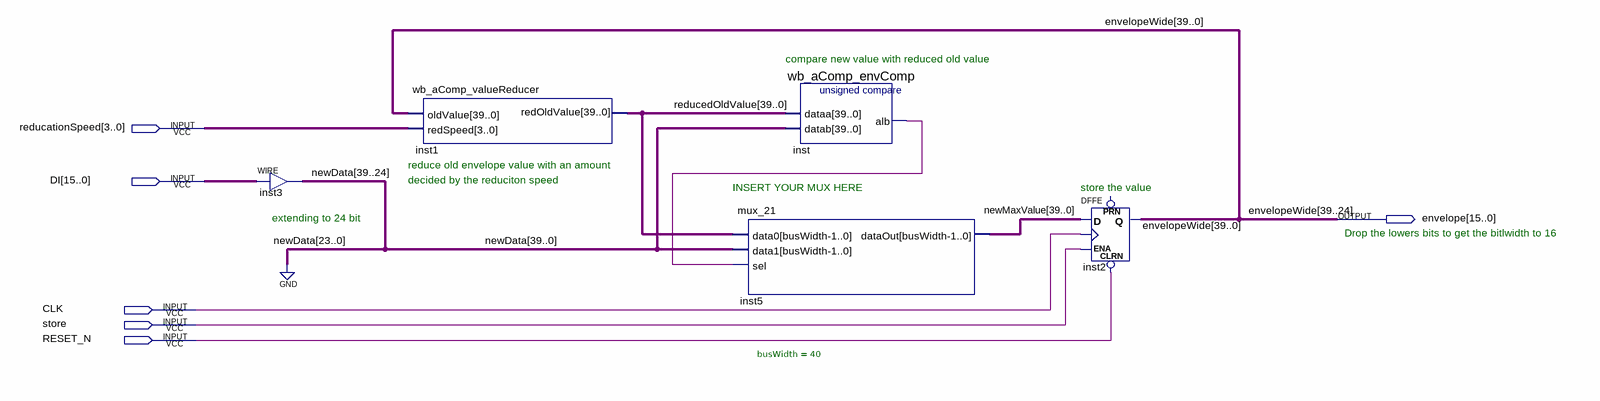
[diagram p0: schematic sheet]
// Quartus schematic wb_aComp_envShape.bdf as structural Verilog: 5 symbols, 6 pins
module wb_aComp_envShape (
  input  [3:0] reducationSpeed,
  input  [15:0] DI,
  input  CLK,
  input  store,
  input  RESET_N,
  output [15:0] envelope
);

  wire inst_alb;
  wire [23:0] envelopeWide;
  wire [39:0] newMaxValue, reducedOldValue;
  wire [39:24] newData;

  assign newData = DI;  // WIRE inst3
  wb_aComp_valueReducer inst1 (
    .oldValue({envelope, envelopeWide}), .redSpeed(reducationSpeed), .redOldValue(reducedOldValue));
  mux_21 #(.busWidth(40)) inst5 (
    .data0(reducedOldValue), .data1({newData, {24{1'b0}}}), .sel(inst_alb), .dataOut(newMaxValue));
  wb_aComp_envComp inst (.dataa(reducedOldValue), .datab({newData, {24{1'b0}}}), .alb(inst_alb));
  DFFE inst2[39:0] (
    .CLRN(RESET_N), .D(newMaxValue), .CLK(CLK), .ENA(store), .Q({envelope, envelopeWide}));  // open: PRN

  // Other names for the same wires on the sheet: envelopeWide[39:24] = envelope

  // Notes on the sheet:
  //   compare new value with reduced old value
  //   reduce old envelope value with an amount
  //   decided by the reduciton speed
  //   INSERT YOUR MUX HERE
  //   store the value
  //   extending to 24 bit
  //   Drop the lowers bits to get the bitlwidth to 16
endmodule
